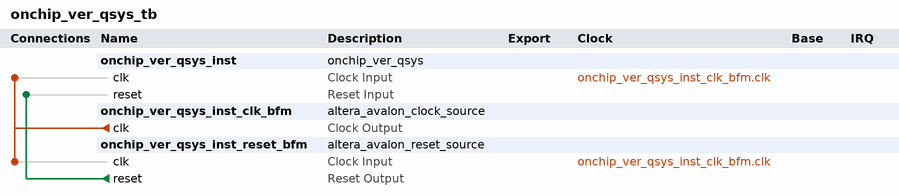
[diagram p0: system contents]
# Platform Designer (Qsys) system onchip_ver_qsys_tb, Cyclone IV GX EP4CGX150DF31C7
# Parameters at their usual value, and those the tool derives, are not listed.
package require -exact qsys 13.0
create_system onchip_ver_qsys_tb
set_project_property DEVICE_FAMILY {Cyclone IV GX}
set_project_property DEVICE EP4CGX150DF31C7

add_instance onchip_ver_qsys_inst onchip_ver_qsys 1.0

add_instance onchip_ver_qsys_inst_clk_bfm altera_avalon_clock_source 13.0

add_instance onchip_ver_qsys_inst_reset_bfm altera_avalon_reset_source 13.0
set_instance_parameter_value onchip_ver_qsys_inst_reset_bfm ASSERT_HIGH_RESET 0
set_instance_parameter_value onchip_ver_qsys_inst_reset_bfm INITIAL_RESET_CYCLES 50

# connections
add_connection onchip_ver_qsys_inst_clk_bfm.clk onchip_ver_qsys_inst.clk clock
add_connection onchip_ver_qsys_inst_clk_bfm.clk onchip_ver_qsys_inst_reset_bfm.clk clock
add_connection onchip_ver_qsys_inst_reset_bfm.reset onchip_ver_qsys_inst.reset reset

set_interconnect_requirement {$system} qsys_mm.clockCrossingAdapter HANDSHAKE
set_interconnect_requirement {$system} qsys_mm.maxAdditionalLatency 1

save_system onchip_ver_qsys_tb.qsys
